# Altium schematic sheet Temperatura.SchDoc
size A4
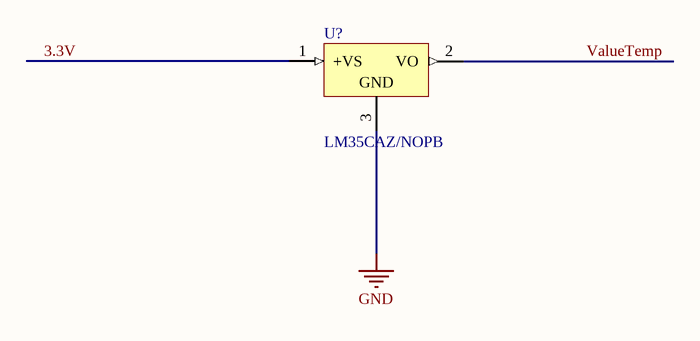
[diagram p0: Temperatura.SchDoc]

## Parts
U?  LM35CAZ/NOPB  [Z03A]

## Nets
GND: U?.3(GND)
3.3V: U?.1(+VS)
ValueTemp: U?.2(VO)

## Library data of the parts
U? = LM35CAZ/NOPB: Precision Centigrade Temperature Sensor, 3-pin TO-92, Pb-Free; Manufacturer: National Semiconductor; PackageTopMarking: NSXYTT*LM35*CAZ; PowerWise: N; CompType: Temp Sensor IC; Published: 1-Mar-2010; DatasheetVersion: Nov-2000; PackageVersion: revG, Sep-2000; PackageReference: Z03A; Publisher: Altium Limited; PackageDescription: TO-92, Molded, 3 Lead; Supplier 1: Digi-Key; Supplier Part Number 1: LM35CAZ-ND; Supplier 2: Farnell; Supplier Part Number 2: 1469232; PartNumber: LM35CAZ/NOPB; RoHS: Y; PinCount: 3; Code_JEDEC: TO-226-AA; ComponentLink1Description: LM35 Datasheet; ComponentLink1URL: http://www.national.com/ds/LM/LM35.pdf; ComponentLink2Description: LM35 Web Page; ComponentLink2URL: http://www.national.com/pf/LM/LM35.html; ComponentLink3Description: Z03A Package Page; ComponentLink3URL: http://www.national.com/packaging/folders/z03a.html